# EAGLE design Amplificador (EAGLE 8.3.2)
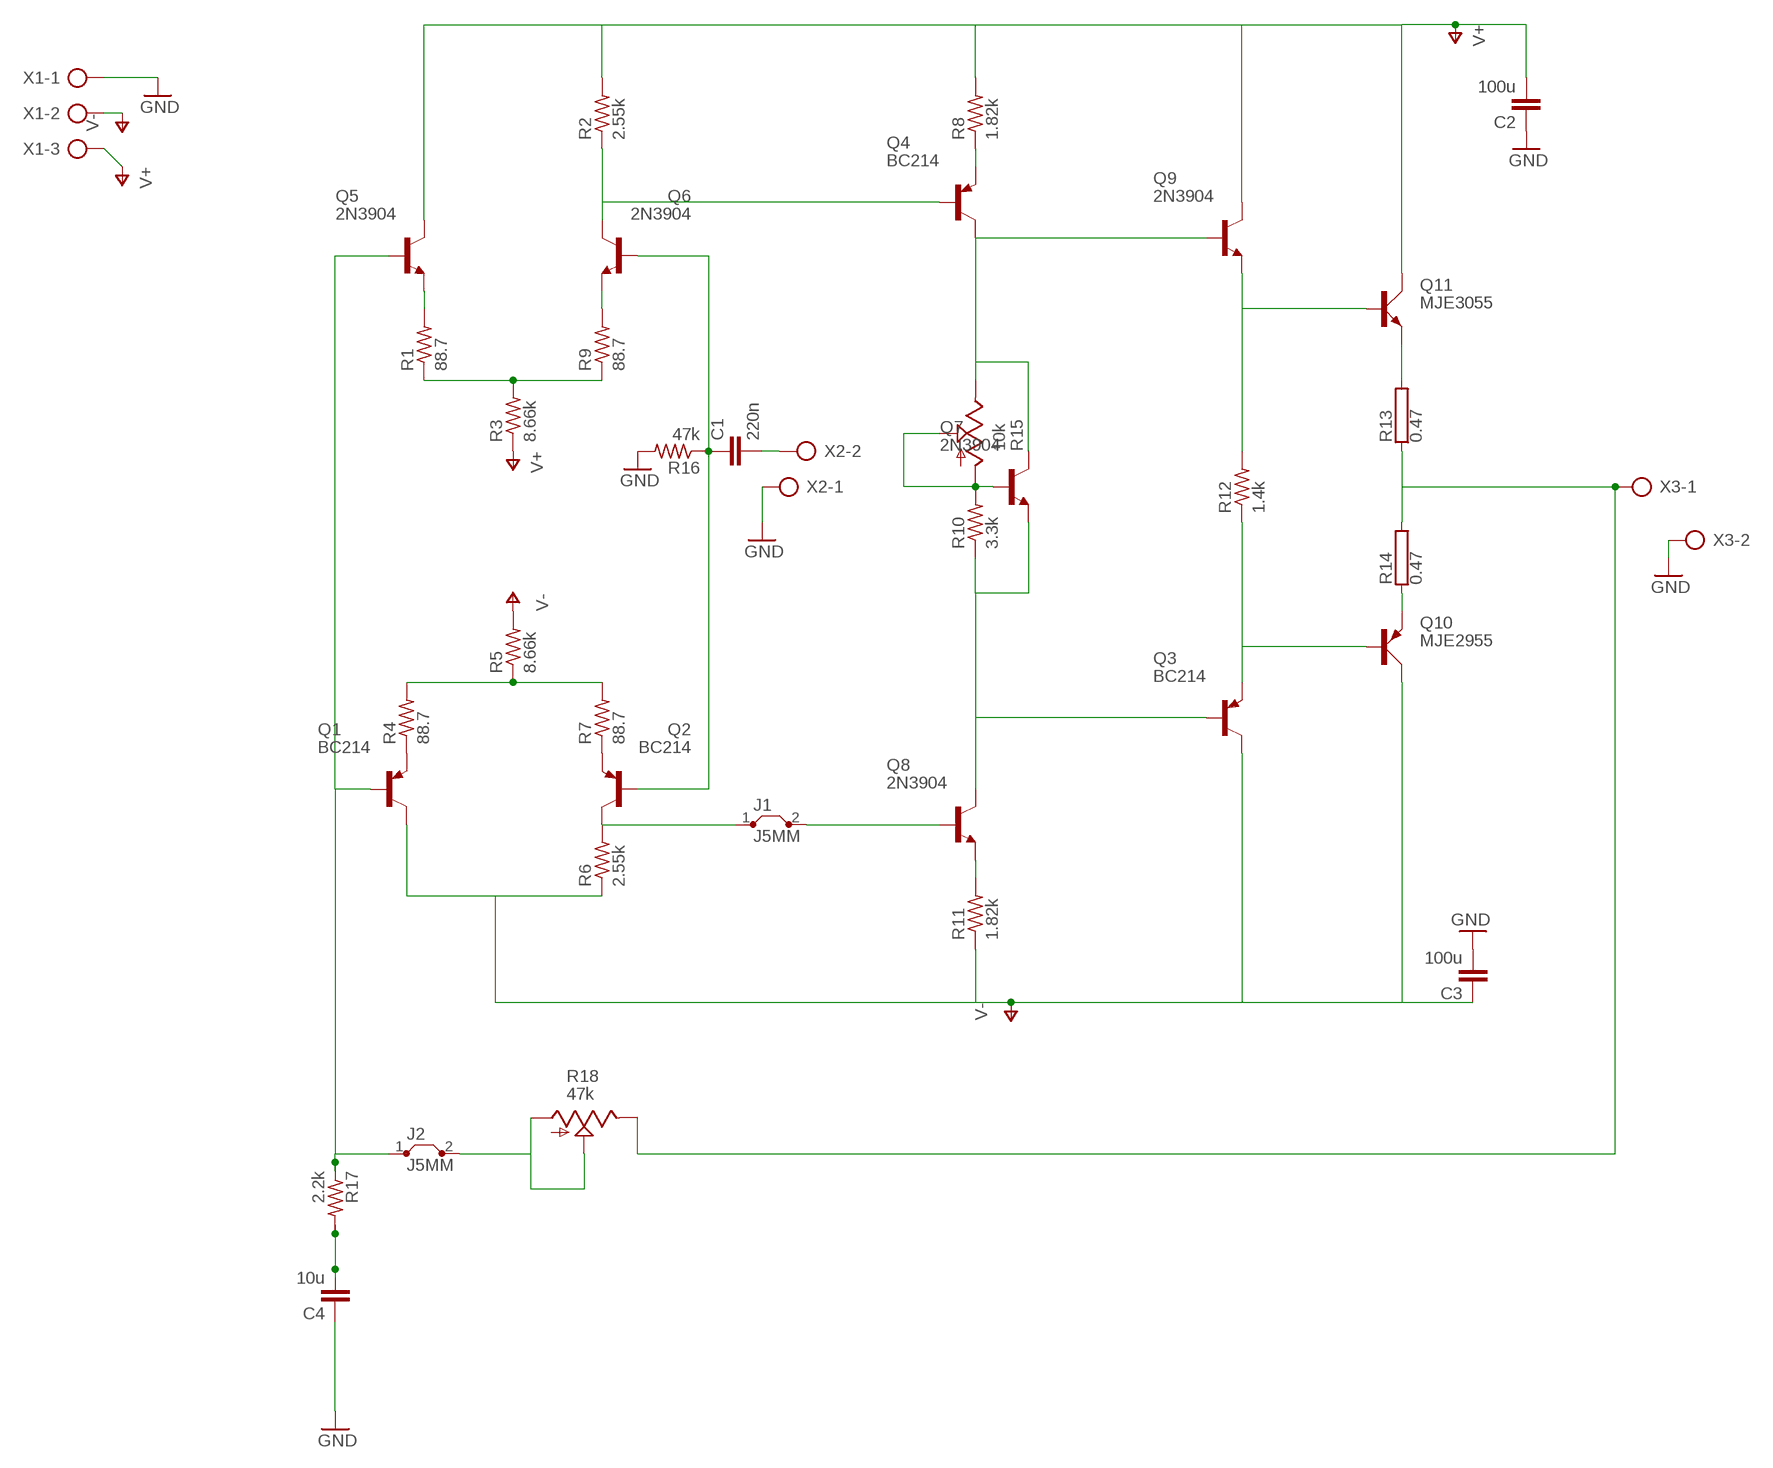
[diagram p0: schematic, sheet 1]

## Parts
C1  220n  C5/2.5  [C5B2.5]
C2  100u  C5/2.5  [C5B2.5]
C3  100u  C5/2.5  [C5B2.5]
C4  10u  C5/2.5  [C5B2.5]
J1  J5MM  [05]
J2  J5MM  [05]
Q1  BC214  [TO92]
Q2  BC214  [TO92]
Q3  BC214  [TO92]
Q4  BC214  [TO92]
Q5  2N3904  [TO92]
Q6  2N3904  [TO92]
Q7  2N3904  [TO92]
Q8  2N3904  [TO92]
Q9  2N3904  [TO92]
Q10  MJE2955  [TO220AV]
Q11  MJE3055  [TO220AV]
R1  88.7  R-US_0207/10  [0207/10]
R2  2.55k  R-US_0207/10  [0207/10]
R3  8.66k  R-US_0207/10  [0207/10]
R4  88.7  R-US_0207/10  [0207/10]
R5  8.66k  R-US_0207/10  [0207/10]
R6  2.55k  R-US_0207/10  [0207/10]
R7  88.7  R-US_0207/10  [0207/10]
R8  1.82k  R-US_0207/10  [0207/10]
R9  88.7  R-US_0207/10  [0207/10]
R10  3.3k  R-US_0207/10  [0207/10]
R11  1.82k  R-US_0207/10  [0207/10]
R12  1.4k  R-US_0207/10  [0207/10]
R13  0.47  RCA4055  [CA4055]
R14  0.47  RCA4055  [CA4055]
R15  10k  TRIM_US-CA6V  [CA6V]
R16  47k  R-US_0207/10  [0207/10]
R17  2.2k  R-US_0207/10  [0207/10]
R18  47k  TRIM_US-CA6H  [CA6H]
X1  AK500/3-H  [AK500/3-H]
X2  AK500/2-H  [AK500/2-H]
X3  AK500/2-H  [AK500/2-H]

## Nets
GND: C2.1 C3.2 C4.1 R16.2 X1.1 X2.1 X3.2
N$1: R4.2 R5.1 R7.2
N$2: J1.2 Q8.2(B)
N$3: Q3.1(E) Q10.B R12.1
N$4: Q5.3(E) R1.2
N$5: Q4.2(B) Q6.1(C) R2.1
N$6: Q8.3(E) R11.2
N$7: Q4.3(C) Q7.1(C) Q9.2(B) R15.E
N$8: Q7.2(B) R10.2 R15.A R15.S
N$9: R1.1 R3.2 R9.1
N$10: Q6.3(E) R9.2
N$11: Q1.1(E) R4.1
N$12: Q2.1(E) R7.1
N$13: C1.2 X2.2
N$14: C1.1 Q2.2(B) Q6.2(B) R16.1
N$15: R13.1 R14.2 R18.E X3.1
N$16: Q3.2(B) Q7.3(E) Q8.1(C) R10.1
N$17: Q4.1(E) R8.1
N$18: C4.2 R17.2
N$19: J2.2 R18.A R18.S
N$21: Q9.3(E) Q11.B R12.2
N$23: Q11.E R13.2
N$24: Q10.E R14.1
N$25: J1.1 Q2.3(C) R6.2
N$26: J2.1 Q1.2(B) Q5.2(B) R17.1
V+: C2.2 Q5.1(C) Q9.1(C) Q11.C R2.2 R3.1 R8.2 X1.3
V-: C3.1 Q1.3(C) Q3.3(C) Q10.C R5.2 R6.1 R11.1 X1.2

## Library data of the parts
C1-C4 = capacitor-wima:C: CAPACITOR naming: grid - package width
J1 J2 = jumper:J: Bridge
Q1-Q4 = transistor-pnp:BC214: PNP Transistor
Q5-Q9 = transistor-npn:2N3904: NPN Transistor
Q10 = transistor-power:MJE2955: PNP TRANSISTOR
Q11 = transistor-power:MJE3055: NPN TRANSISTOR
R1-R12 R16 R17 = resistor:R-US_: RESISTOR, American symbol
R13 R14 = resistor-power:R: Power Resitor; OC_FARNELL: unknown; OC_NEWARK: unknown
R15 R18 = pot:TRIM_US-: POTENTIOMETER
X1 = con-ptr500:AK500/3-H: CONNECTOR Aug. 2004 / PTR Meßtechnik: Die Bezeichnung der Serie AK505 wurde geändert. Es handelt sich hierbei um AK500 in horizontaler Ausführung.; OC_FARNELL: unknown; OC_NEWARK: unknown
X2 X3 = con-ptr500:AK500/2-H: CONNECTOR Aug. 2004 / PTR Meßtechnik: Die Bezeichnung der Serie AK505 wurde geändert. Es handelt sich hierbei um AK500 in horizontaler Ausführung.; OC_FARNELL: unknown; OC_NEWARK: unknown

## Net classes
0 My: width 1 mm, drill 3 mm, clearance 1 mm

## Board
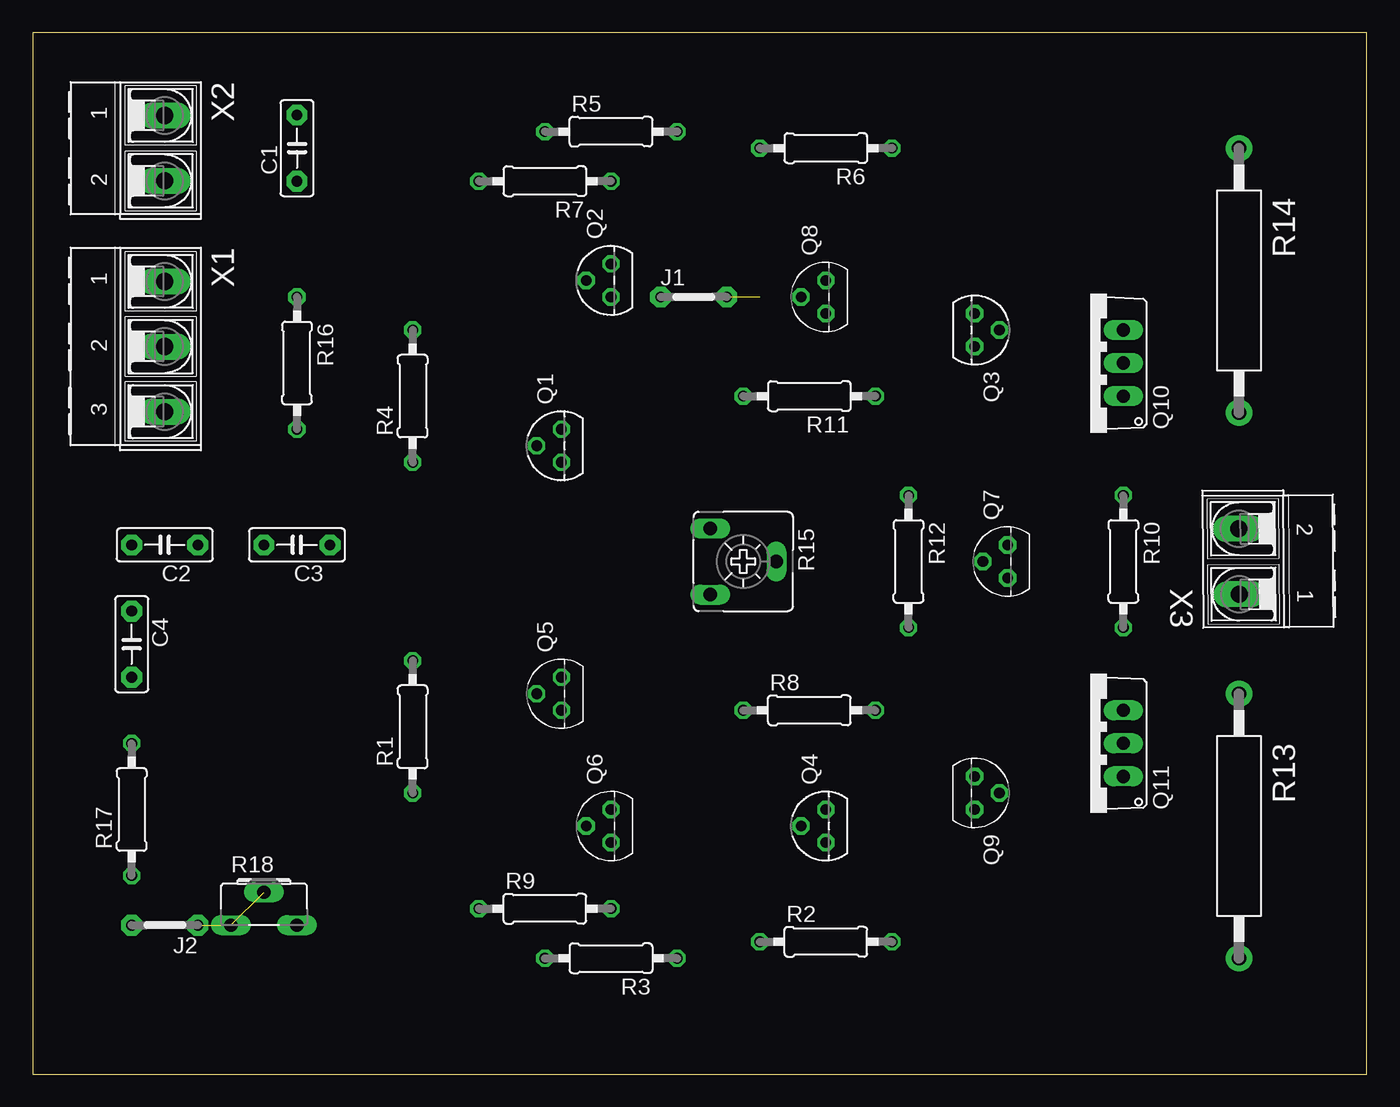
[diagram p1: board, top side]
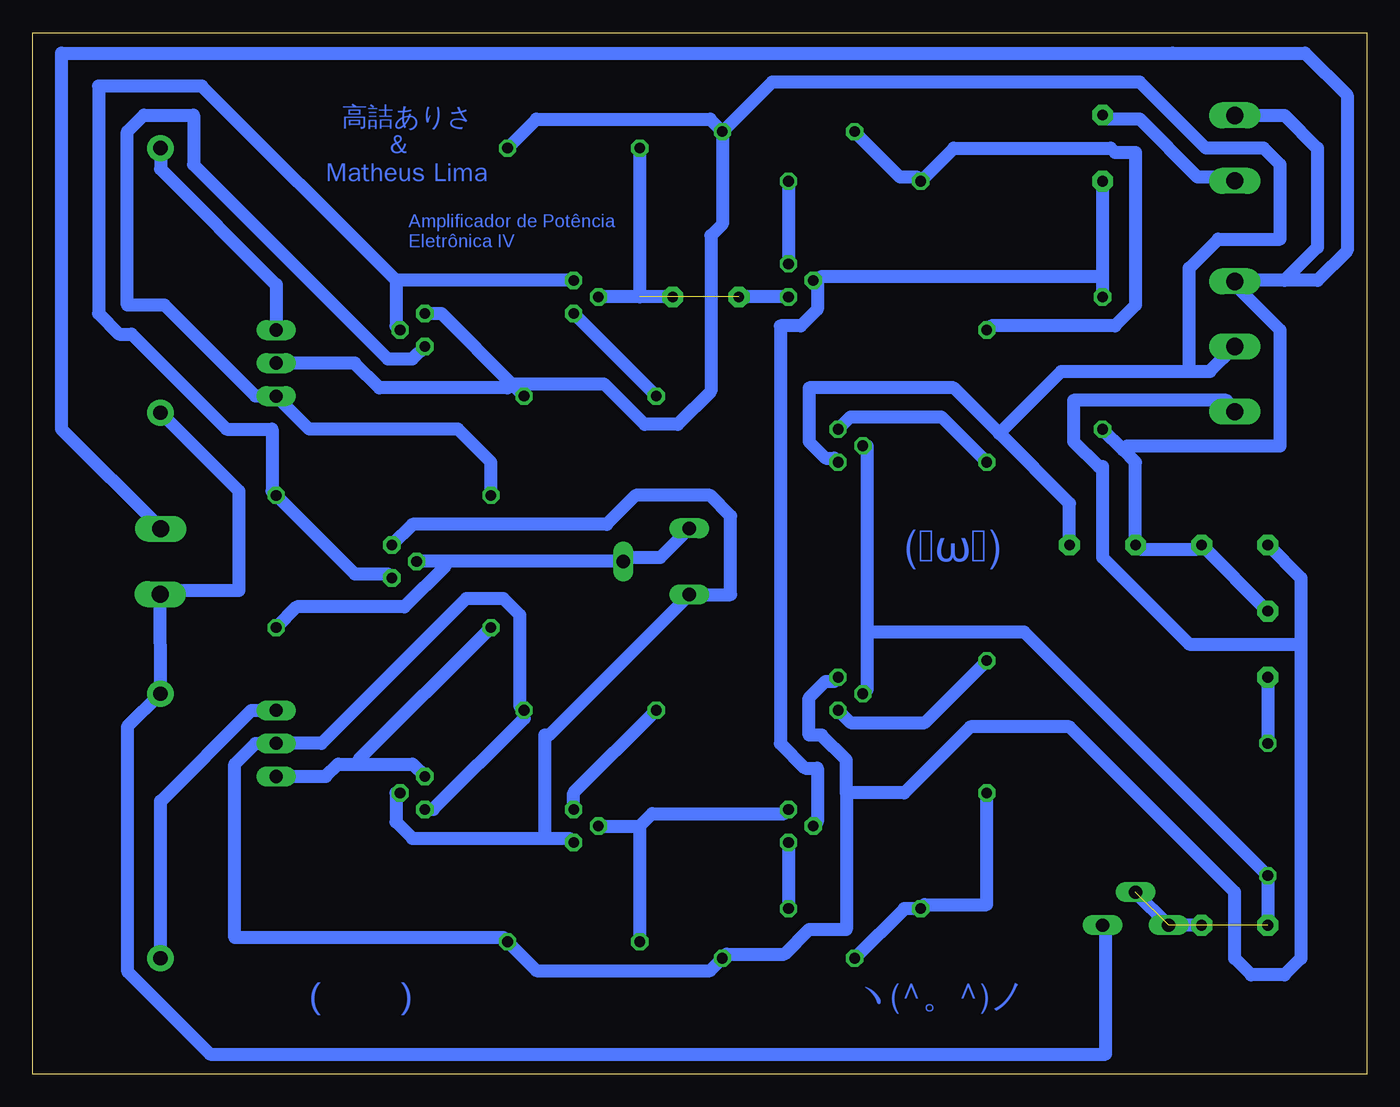
[diagram p2: board, bottom side, seen from below]

Size 102.54 x 80 mm. Coordinates in mm from the lower left corner, seen from the top.
Outline: 0,0 102.54,0 102.54,80 0,80 0,0
Copper layers (1*16): Top 0.035mm / dielectric 1.5mm / Bottom 0.035mm
Design rules "default": minimum track width 6mil, minimum drill 0.35mm, track to track 6mil, track to pad 6mil, pad to pad 6mil, via to via 6mil, smd to smd 6mil, copper to edge 40mil, drill to drill 6mil, minimum pad ring 10mil, minimum via ring 8mil, stop-mask expansion 4mil, vias tented up to drill 0mil, thermal gap 10mil

### Footprints (pad centres in the part's own frame; a part is rotated, then mirrored left to right if it is on the bottom)
C5B2.5 = drill 0.813 pad 1.6 octagon: 1 -2.54,0; 2 2.54,0
05 = drill 0.813 pad 1.6 octagon: 1 -2.54,0; 2 2.54,0
TO92 = drill 0.813 octagon: 1 1.27,0; 2 0,1.905; 3 -1.27,0
TO220AV = drill 1.016 long: B -2.54,-2.54; C 0,-2.54; E 2.54,-2.54
0207/10 = drill 0.813 octagon: 1 -5.08,0; 2 5.08,0
CA4055 = drill 1.1 pad 2: 1 -10.16,0; 2 10.16,0
CA6V = drill 1.016 long: A -2.54,-2.54; E 2.54,-2.54; S 0,2.54
CA6H = drill 1.016 long: A -2.54,0; E 2.54,0; S 0,2.54
AK500/3-H = drill 1.321 long: 1 -5.004,0; 2 0,0; 3 5.004,0
AK500/2-H = drill 1.321 long: 1 -2.515,0; 2 2.515,0

### Placement (x,y rotation side)
C1  20.32,71.12 90 top
C2  10.16,40.64 180 top
C3  20.32,40.64 180 top
C4  7.62,33.02 270 top
J1  50.8,59.69 0 top
J2  10.16,11.43 180 top
Q1  40.64,48.26 90 top
Q2  44.45,60.96 90 top
Q3  72.39,57.15 270 top
Q4  60.96,19.05 90 top
Q5  40.64,29.21 90 top
Q6  44.45,19.05 90 top
Q7  74.93,39.37 90 top
Q8  60.96,59.69 90 top
Q9  72.39,21.59 270 top
Q10  81.28,54.61 90 top
Q11  81.28,25.4 90 top
R1  29.21,26.67 90 top
R2  60.96,10.16 0 top
R3  44.45,8.89 180 top
R4  29.21,52.07 90 top
R5  44.45,72.39 0 top
R6  60.96,71.12 180 top
R7  39.37,68.58 180 top
R8  59.69,27.94 0 top
R9  39.37,12.7 0 top
R10  83.82,39.37 270 top
R11  59.69,52.07 180 top
R12  67.31,39.37 270 top
R13  92.71,19.05 270 top
R14  92.71,60.96 270 top
R15  54.61,39.37 270 top
R16  20.32,54.61 270 top
R17  7.62,20.32 90 top
R18  17.78,11.43 0 top
X1  10.16,55.88 270 top
X2  10.16,71.12 270 top
X3  92.71,39.37 90.4 top

### Tracks (layer width: path | path; a pad name or v marks a point on that pad's centre or on a via)
GND
  Bottom 1: C4.1 C2.1 13.02,40.32 17.46,40.32 C3.2 17.78,46.99 18.73,47.94 | 18.73,47.94 R16.2 | X1.1 10.16,60.64 6.67,57.15 6.67,48.26 18.41,48.26 18.73,47.94 | 14.92,78.42 100.33,78.42 100.33,49.53 92.71,41.91 X3.2 | 10.16,73.66 X2.1 9.84,73.34
  Bottom 1.016: 14.92,78.42 4.76,78.42 1.52,75.18 1.52,63.25 3.81,60.96 6.35,60.96 | 10.1,60.66 8.57,60.96 | 10.1,60.66 10.16,60.64 | X2.1 6.33,73.64 3.81,71.12 3.81,63.5 6.35,60.96 | 6.35,60.96 9.79,60.96 10.1,60.66
N$1
  Bottom 1: R4.2 28.89,57.47 19.37,57.47 17.78,59.05 17.78,70.8 19.37,70.8 19.68,71.12 31.75,71.12 R7.2 34.61,68.9 35.88,68.9 R5.1
N$2
  Bottom 1.016: J1.2 Q8.2
N$3
  Bottom 1: Q3.1 73.34,54.93 75.25,54.93 90.17,69.85 90.17,73.66 93.98,73.66 95.25,72.39 95.25,59.05 92.39,59.05 85.41,52.07 Q10.B
  Bottom 1.016: R12.1 67.31,46.99 69.85,49.53 81.28,49.53 Q10.B
N$4
  Bottom 1: R1.2 33.97,26.99 39.69,26.99 Q5.3
N$5
  Bottom 1: 55.88,19.05 R2.1 | Q4.2 55.88,19.05 | Q6.1 44.77,20 54.93,20 55.88,19.05
N$6
  Bottom 1: Q8.3 R11.2
N$7
  Bottom 1: Q4.3 61.28,18.1 63.18,18.1 | 63.18,18.1 73.34,18.1 74.61,19.37 74.61,21.59 Q9.2 | Q7.1 73.34,42.23 58.42,42.23 56.2,44.45 50.48,44.45 48.89,42.86 48.89,36.83 R15.E 62.87,26.04 63.18,26.04 63.18,18.1
N$8
  Bottom 1: 70.8,39.37 R15.S 56.83,39.69 54.29,39.69 R15.A | 70.8,39.37 Q7.2 | R10.2 82.23,35.88 73.98,35.88 70.8,39.05 70.8,39.37
N$9
  Bottom 1: R3.2 35.56,12.7 R9.1 33.97,13.02 29.21,13.02 R1.1
N$10
  Bottom 1: Q6.3 R9.2
N$11
  Bottom 1: R4.1 32.7,50.48 39.69,50.48 Q1.1
N$12
  Bottom 1: R7.1 Q2.1
N$13
  Bottom 1: C1.2 20,73.34 17.46,73.34 13.02,68.9 10.16,68.9 X2.2
N$14
  Bottom 1: C1.1 20.32,61.28 | 20.32,61.28 R16.1 | Q6.2 42.23,19.37 42.23,23.5 43.18,23.5 45.09,25.4 45.09,57.47 43.5,57.47 42.23,58.74 42.23,60.96 | Q2.2 42.23,60.96 | 20.32,61.28 41.91,61.28 42.23,60.96
N$15
  Bottom 1: R13.1 X3.1 92.39,37.15 86.68,37.15 86.68,44.77 R14.2
  Bottom 1.016: R13.1 95.25,26.67 95.22,26.64 95.22,7.85 88.89,1.52 20.07,1.52 20.07,11.18 R18.E
N$16
  Bottom 1: Q7.3 75.25,38.42 77.79,38.42 R10.1 84.14,44.77 84.14,49.53 87.63,49.53 94.93,56.83 95.89,56.83 97.47,58.42 97.47,75.88 89.54,75.88 74.61,60.96 | Q3.2 74.61,57.47 74.61,60.96 | Q8.1 74.61,60.96
N$17
  Bottom 1: R8.1 60.96,21.59 Q4.1
N$18
  Bottom 1: C4.2 R17.2
N$19  (2 unrouted)
N$20  (1 unrouted)
N$21
  Bottom 1: Q9.3 73.34,23.81 77.47,23.81 | 77.47,23.81 79.06,23.81 80.01,22.86 Q11.B | R12.2 77.47,24.13 77.47,23.81
N$22  (1 unrouted)
N$23
  Bottom 1: Q11.E 85.73,27.94 92.71,20.95 R13.2
N$24
  Bottom 1: Q10.E 83.82,60.64 92.71,69.53 R14.1
N$25  (1 unrouted)
  Bottom 1.016: Q2.3 J1.1 | R6.2 55.88,59.69
N$26  (1 unrouted)
  Bottom 1: Q5.2 38.42,29.53 38.42,33.97 | 38.42,33.97 38.42,48.26 Q1.2 | 38.42,33.97 28.26,33.97
  Bottom 1.016: 28.26,33.97 26.35,33.97 R17.1 7.62,11.43 | J2.1 15.24,11.43 17.78,13.97
V+
  Bottom 1: Q9.1 71.76,20.32 64.77,27.3 R8.2 65.09,28.26 65.09,35.24 66.36,36.51 69.22,36.51 80.33,25.4 Q11.C 85.41,25.4 87,23.81 87,10.48 66.36,10.48 R2.2 63.82,7.94 50.48,7.94 R3.1 49.21,9.21 44.77,9.21 42.86,11.11 40.01,11.11 40.01,21.59 40.01,24.13 41.91,26.04 42.86,26.04 42.86,28.89 41.59,30.16 40.96,30.16 Q5.1 | C2.2 5.08,38.1 5.08,33.02 13.65,33.02 20.32,39.69 20.32,46.67 20.64,46.67 22.54,48.58 22.54,51.75 10.8,51.75 10.16,51.12 X1.3
  Bottom 1.016: 40.01,21.59 35.56,21.59 30.48,26.67 22.86,26.67 10.16,13.97 10.16,8.89 8.89,7.62 6.35,7.62 5.08,8.89 5.08,33.02
V-
  Bottom 1: R6.1 63.82,73.34 50.48,73.34 R5.2 45.72,76.2 17.46,76.2 12.38,71.12 7.94,71.12 6.67,69.85 6.67,64.14 11.43,64.14 13.65,61.91 13.65,53.98 | Q1.3 40.96,47.31 41.59,47.31 42.86,48.58 42.86,52.7 31.75,52.7 28.26,49.21 | 28.26,49.21 22.86,43.81 C3.1 | X1.2 12.07,53.98 13.65,53.98 | 13.65,53.98 23.49,53.98 28.26,49.21 | 65.72,53.02 71.12,58.42 Q3.3 | 65.72,53.02 R11.1 | Q10.C 77.79,54.61 75.88,52.7 66.04,52.7 65.72,53.02
  Bottom 1.016: 65.72,53.02 58.63,53.02 55.51,49.9 52.97,49.9 50.42,52.45 50.42,64.39 49.53,65.28 R5.2

### Text on the board
Bottom: 高詰ありさ / & / Matheus Lima | ☆ | Amplificador de Potência / Eletrônica IV | (･ω･) | 𝄞 | ヽ(^。^)ノ | (≧▽≦)